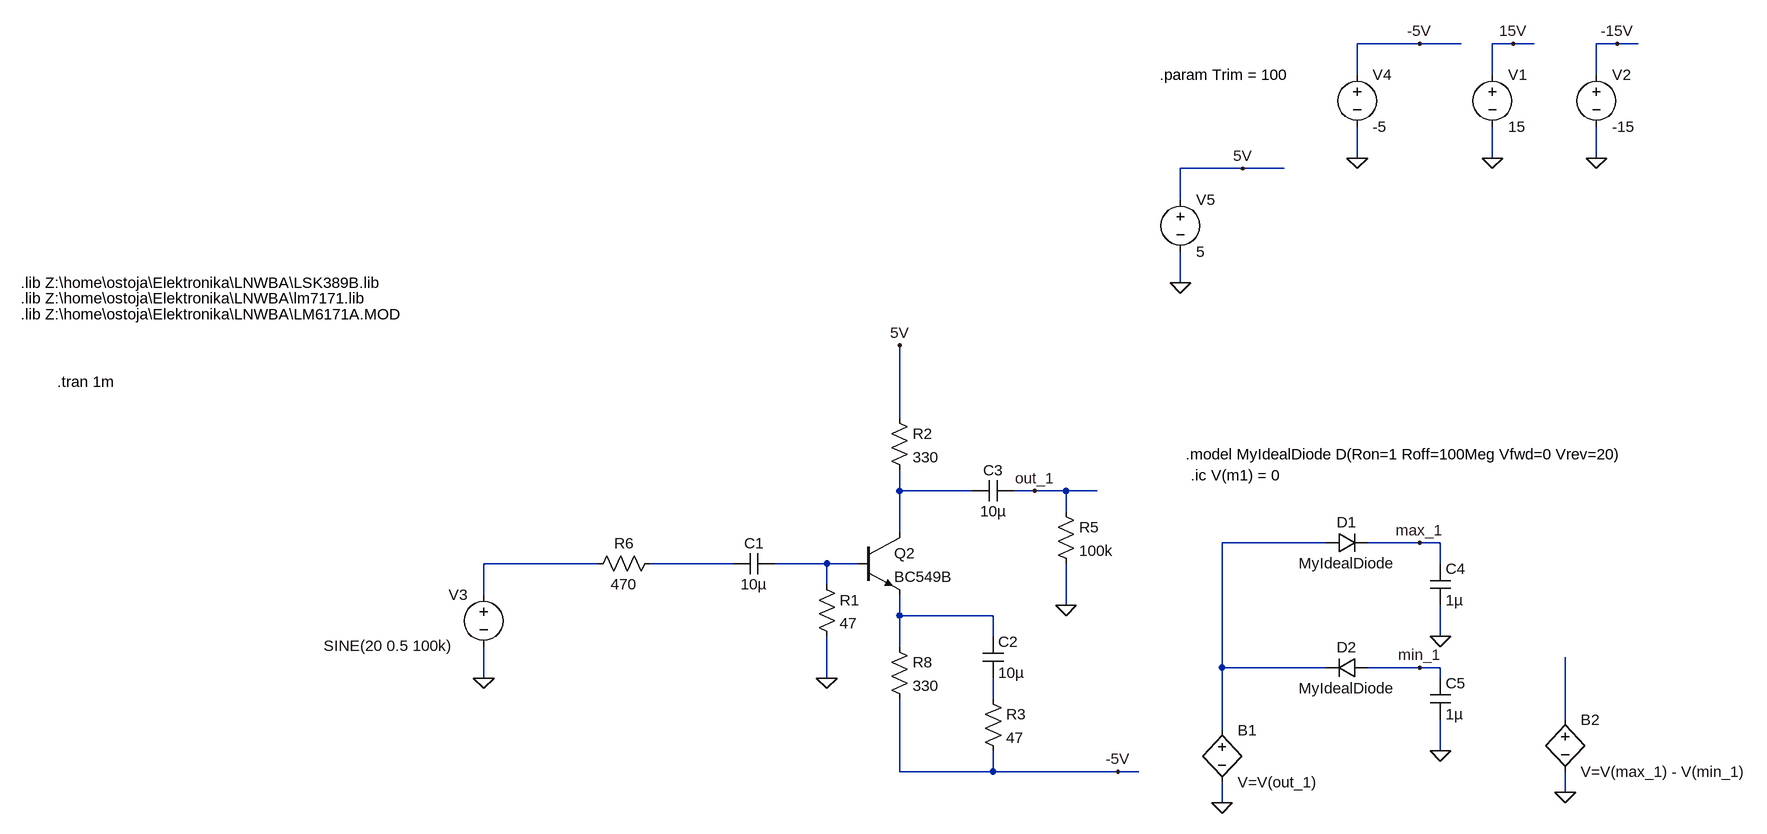
[diagram p0: schematic LNWBA_bjt_class_A.asc]
LNWBA_bjt_class_A.asc, the LTspice schematic file:
Version 4
SHEET 1 2516 820
WIRE 960 -592 864 -592
WIRE 1024 -592 960 -592
WIRE 1104 -592 1072 -592
WIRE 1136 -592 1104 -592
WIRE 1264 -592 1232 -592
WIRE 1296 -592 1264 -592
WIRE 864 -544 864 -592
WIRE 1072 -544 1072 -592
WIRE 1232 -544 1232 -592
WIRE 864 -416 864 -464
WIRE 1072 -416 1072 -464
WIRE 1232 -416 1232 -464
WIRE 688 -400 592 -400
WIRE 752 -400 688 -400
WIRE 592 -352 592 -400
WIRE 592 -224 592 -272
WIRE 160 -16 160 -128
WIRE 160 96 160 64
WIRE 272 96 160 96
WIRE 368 96 336 96
WIRE 416 96 368 96
WIRE 464 96 416 96
WIRE 416 128 416 96
WIRE 160 160 160 96
WIRE 816 176 656 176
WIRE 960 176 880 176
WIRE 992 176 960 176
WIRE -304 208 -480 208
WIRE -96 208 -224 208
WIRE 48 208 -32 208
WIRE 96 208 48 208
WIRE 992 208 992 176
WIRE 48 240 48 208
WIRE -480 256 -480 208
WIRE 416 272 416 208
WIRE 160 288 160 256
WIRE 304 288 160 288
WIRE 304 320 304 288
WIRE 992 320 992 272
WIRE 160 336 160 288
WIRE 656 368 656 176
WIRE 816 368 656 368
WIRE 960 368 880 368
WIRE 992 368 960 368
WIRE -480 384 -480 336
WIRE 48 384 48 320
WIRE 992 384 992 368
WIRE 304 416 304 384
WIRE 1184 448 1184 352
WIRE 656 464 656 368
WIRE 992 496 992 448
WIRE 160 528 160 416
WIRE 304 528 304 496
WIRE 304 528 160 528
WIRE 496 528 304 528
WIRE 528 528 496 528
WIRE 1184 560 1184 528
WIRE 656 576 656 544
FLAG 1104 -592 15V
FLAG 1264 -592 -15V
FLAG 1232 -416 0
FLAG 1072 -416 0
FLAG -480 384 0
FLAG 960 -592 -5V
FLAG 864 -416 0
FLAG 48 384 0
FLAG 160 -128 5V
FLAG 496 528 -5V
FLAG 416 272 0
FLAG 688 -400 5V
FLAG 592 -224 0
FLAG 368 96 out_1
FLAG 656 576 0
FLAG 992 320 0
FLAG 992 496 0
FLAG 960 176 max_1
FLAG 960 368 min_1
FLAG 1184 560 0
SYMBOL voltage 1072 -560 R0
WINDOW 123 0 0 Left 0
WINDOW 39 0 0 Left 0
SYMATTR InstName V1
SYMATTR Value 15
SYMBOL voltage 1232 -560 R0
WINDOW 123 0 0 Left 0
WINDOW 39 0 0 Left 0
SYMATTR InstName V2
SYMATTR Value -15
SYMBOL voltage -480 240 M0
WINDOW 123 0 0 Left 0
WINDOW 39 0 0 Left 0
WINDOW 3 47 94 Left 2
SYMATTR InstName V3
SYMATTR Value SINE(20 0.5 100k)
SYMBOL voltage 864 -560 R0
WINDOW 123 0 0 Left 0
WINDOW 39 0 0 Left 0
SYMATTR InstName V4
SYMATTR Value -5
SYMBOL cap -32 192 R90
WINDOW 0 0 32 VBottom 2
WINDOW 3 32 32 VTop 2
SYMATTR InstName C1
SYMATTR Value 10µ
SYMBOL res 32 224 R0
SYMATTR InstName R1
SYMATTR Value 47
SYMBOL npn 96 160 R0
SYMATTR InstName Q2
SYMATTR Value BC549B
SYMBOL res 144 -32 R0
SYMATTR InstName R2
SYMATTR Value 330
SYMBOL cap 288 384 M180
WINDOW 0 24 56 Left 2
WINDOW 3 24 8 Left 2
SYMATTR InstName C2
SYMATTR Value 10µ
SYMBOL res 288 400 R0
SYMATTR InstName R3
SYMATTR Value 47
SYMBOL cap 336 80 R90
WINDOW 0 0 32 VBottom 2
WINDOW 3 32 32 VTop 2
SYMATTR InstName C3
SYMATTR Value 10µ
SYMBOL res 400 112 R0
SYMATTR InstName R5
SYMATTR Value 100k
SYMBOL res -208 192 R90
WINDOW 0 0 56 VBottom 2
WINDOW 3 32 56 VTop 2
SYMATTR InstName R6
SYMATTR Value 470
SYMBOL voltage 592 -368 R0
WINDOW 123 0 0 Left 0
WINDOW 39 0 0 Left 0
SYMATTR InstName V5
SYMATTR Value 5
SYMBOL bv 656 448 R0
SYMATTR InstName B1
SYMATTR Value V=V(out_1)
SYMBOL diode 816 192 R270
WINDOW 0 32 32 VTop 2
WINDOW 3 0 32 VBottom 2
SYMATTR InstName D1
SYMATTR Value MyIdealDiode
SYMBOL cap 976 208 R0
SYMATTR InstName C4
SYMATTR Value 1µ
SYMBOL diode 880 352 R90
WINDOW 0 0 32 VBottom 2
WINDOW 3 32 32 VTop 2
SYMATTR InstName D2
SYMATTR Value MyIdealDiode
SYMBOL cap 976 384 R0
SYMATTR InstName C5
SYMATTR Value 1µ
SYMBOL bv 1184 432 R0
SYMATTR InstName B2
SYMATTR Value V=V(max_1) - V(min_1)
SYMBOL res 144 320 R0
SYMATTR InstName R8
SYMATTR Value 330
TEXT -1192 -224 Left 2 !.lib Z:\\home\\ostoja\\Elektronika\\LNWBA\\LSK389B.lib
TEXT -1136 -72 Left 2 !.tran 1m
TEXT -1192 -200 Left 2 !.lib Z:\\home\\ostoja\\Elektronika\\LNWBA\\lm7171.lib
TEXT -1192 -176 Left 2 !.lib Z:\\home\\ostoja\\Elektronika\\LNWBA\\LM6171A.MOD
TEXT 560 -544 Left 2 !.param Trim = 100
TEXT 608 72 Left 2 !.ic V(m1) = 0
TEXT 600 40 Left 2 !.model MyIdealDiode D(Ron=1 Roff=100Meg Vfwd=0 Vrev=20)

The netlist it stands for:
* LNWBA_bjt_class_A.asc
V1 15V 0 15
V2 -15V 0 -15
V3 N003 0 SINE(20 0.5 100k)
V4 -5V 0 -5
C1 N005 N004 10µ
R1 N005 0 47
Q2 N001 N005 N006 0 BC549B
R2 5V N001 330
C2 N007 N006 10µ
R3 N007 -5V 47
C3 out_1 N001 10µ
R5 out_1 0 100k
R6 N004 N003 470
V5 5V 0 5
B1 N002 0 V=V(out_1)
D1 N002 max_1 MyIdealDiode
C4 max_1 0 1µ
D2 min_1 N002 MyIdealDiode
C5 min_1 0 1µ
B2 N008 0 V=V(max_1) - V(min_1)
R8 N006 -5V 330
.model D D
.lib standard.dio
.model NPN NPN
.model PNP PNP
.lib standard.bjt
.lib Z:\home\ostoja\Elektronika\LNWBA\LSK389B.lib
.tran 1m
.lib Z:\home\ostoja\Elektronika\LNWBA\lm7171.lib
.lib Z:\home\ostoja\Elektronika\LNWBA\LM6171A.MOD
.param Trim = 100
.ic V(m1) = 0
.model MyIdealDiode D(Ron=1 Roff=100Meg Vfwd=0 Vrev=20)
.backanno
.end